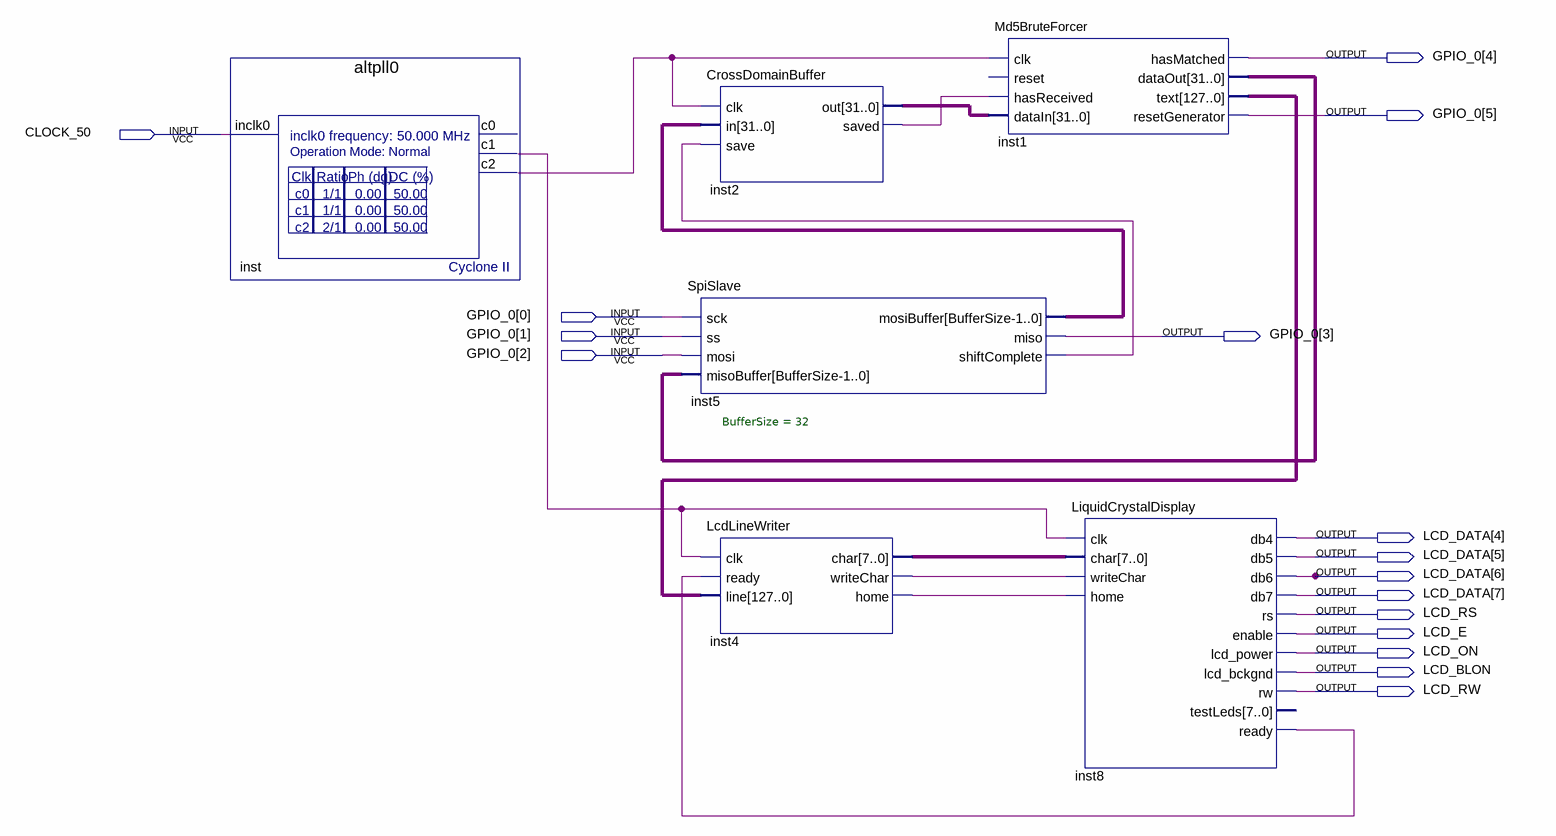
[diagram p0: schematic sheet]
// Quartus schematic fpga_md5.bdf as structural Verilog: 6 symbols, 16 pins
module fpga_md5 (
  input  CLOCK_50,
  inout  [5:0] GPIO_0,
  output [7:4] LCD_DATA,
  output LCD_RS,
  output LCD_E,
  output LCD_ON,
  output LCD_BLON,
  output LCD_RW
);

  wire inst2_saved, inst4_home, inst4_writechar, inst5_shiftcomplete, inst8_ready, inst_c1, inst_c2;
  wire [7:0] inst4_char;
  wire [31:0] inst1_dataout, inst2_out, inst5_mosibuffer;
  wire [127:0] inst1_text;

  altpll0 inst (.inclk0(CLOCK_50), .c1(inst_c1), .c2(inst_c2));  // open: c0
  SpiSlave #(.BufferSize(32)) inst5 (
    .sck(GPIO_0[0]), .ss(GPIO_0[1]), .mosi(GPIO_0[2]), .misoBuffer(inst1_dataout),
    .mosiBuffer(inst5_mosibuffer), .miso(GPIO_0[3]), .shiftComplete(inst5_shiftcomplete));
  CrossDomainBuffer inst2 (
    .clk(inst_c2), .in(inst5_mosibuffer), .save(inst5_shiftcomplete), .out(inst2_out), .saved(inst2_saved));
  LcdLineWriter inst4 (
    .clk(inst_c1), .ready(inst8_ready), .line(inst1_text), .char(inst4_char), .writeChar(inst4_writechar),
    .home(inst4_home));
  Md5BruteForcer inst1 (
    .clk(inst_c2), .hasReceived(inst2_saved), .dataIn(inst2_out), .hasMatched(GPIO_0[4]),
    .dataOut(inst1_dataout), .text(inst1_text), .resetGenerator(GPIO_0[5]));  // open: reset
  LiquidCrystalDisplay inst8 (
    .clk(inst_c1), .char(inst4_char), .writeChar(inst4_writechar), .home(inst4_home), .db4(LCD_DATA[4]),
    .db5(LCD_DATA[5]), .db6(LCD_DATA[6]), .db7(LCD_DATA[7]), .rs(LCD_RS), .enable(LCD_E), .lcd_power(LCD_ON),
    .lcd_bckgnd(LCD_BLON), .rw(LCD_RW), .ready(inst8_ready));  // open: testLeds
endmodule
